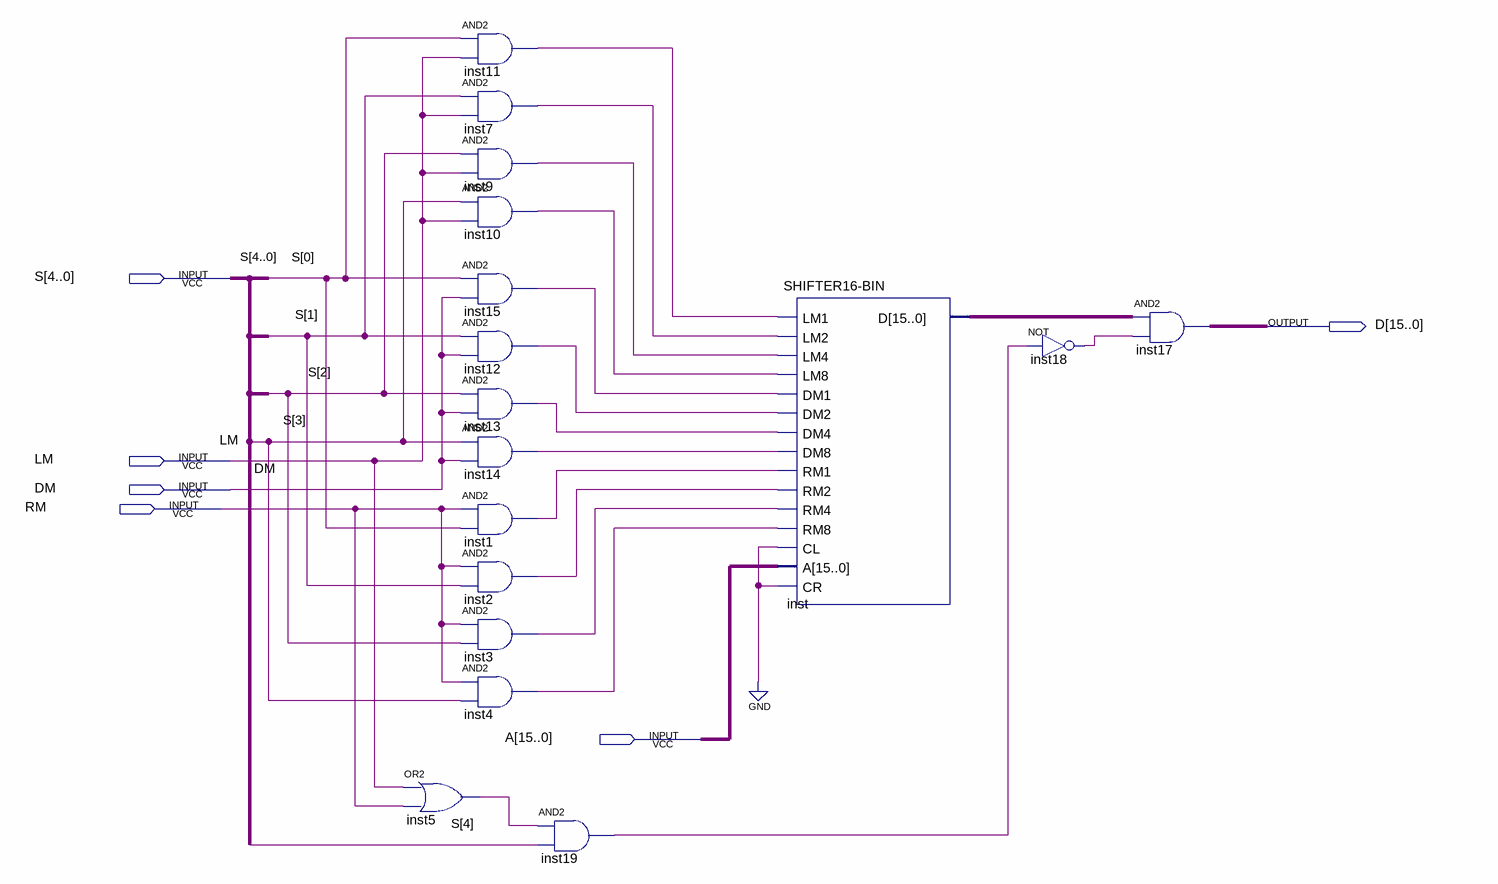
[diagram p0: schematic sheet]
// Quartus schematic SH.bdf as structural Verilog: 17 symbols, 6 pins
module SH (
  input  [4:0] S,
  input  LM,
  input  DM,
  input  RM,
  input  [15:0] A,
  output [15:0] D
);

  wire inst1_out, inst2_out, inst3_out, inst4_out, inst5_out, inst7_out, inst9_out, inst10_out, inst11_out,
       inst12_out, inst13_out, inst14_out, inst15_out, inst18_out, inst19_out;
  wire [15:0] inst_d;

  or inst5 (inst5_out, LM, RM);
  and inst11 (inst11_out, S[0], LM);
  and inst7 (inst7_out, S[1], LM);
  and inst9 (inst9_out, S[2], LM);
  and inst10 (inst10_out, S[3], LM);
  and inst15 (inst15_out, S[0], DM);
  and inst12 (inst12_out, S[1], DM);
  and inst13 (inst13_out, S[2], DM);
  and inst14 (inst14_out, S[3], DM);
  and inst1 (inst1_out, RM, S[0]);
  and inst2 (inst2_out, RM, S[1]);
  and inst3 (inst3_out, RM, S[2]);
  and inst4 (inst4_out, RM, S[3]);
  and inst19 (inst19_out, inst5_out, S[4]);
  \SHIFTER16-BIN  inst (
    .LM1(inst11_out), .LM2(inst7_out), .LM4(inst9_out), .LM8(inst10_out), .DM1(inst15_out), .DM2(inst12_out),
    .DM4(inst13_out), .DM8(inst14_out), .RM1(inst1_out), .RM2(inst2_out), .RM4(inst3_out), .RM8(inst4_out),
    .CL(1'b0), .A(A), .CR(1'b0), .D(inst_d));
  not inst18 (inst18_out, inst19_out);
  assign D = inst_d & {16{inst18_out}};  // AND2 inst17, 16 bits wide
endmodule
